# EAGLE schematic avr-grundschaltung (EAGLE 4.16)
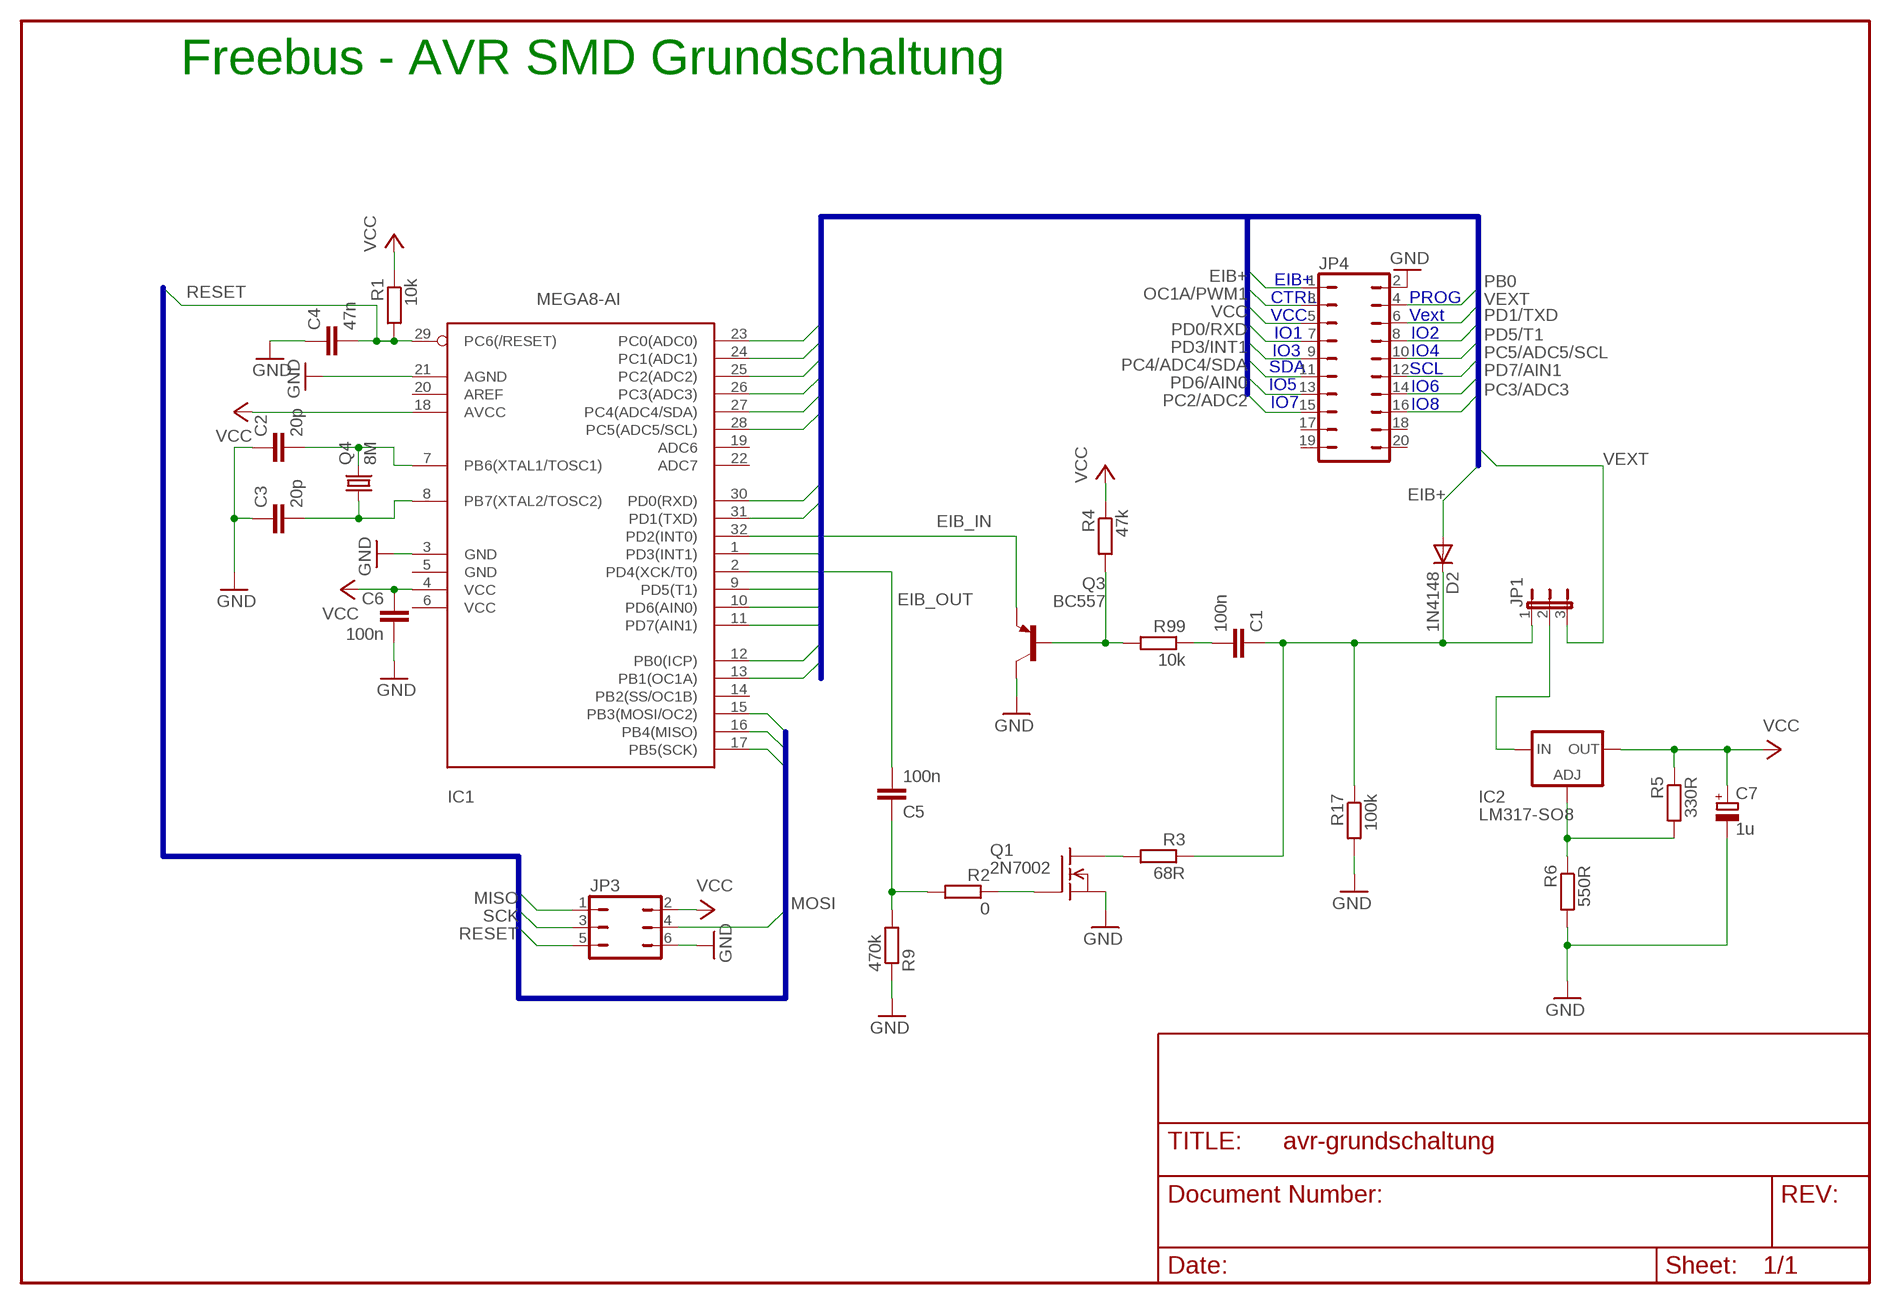
[diagram p0: schematic, sheet 1]

## Parts
C1  100n  C-EUC1206  [C1206]
C2  20p  C-EUC1206  [C1206]
C3  20p  C-EUC1206  [C1206]
C4  47n  C-EUC1206  [C1206]
C5  100n  C-EUC1206  [C1206]
C6  100n  C-EUC1206  [C1206]
C7  1u  CPOL-EUSMCB  [SMC_B]
D2  1N4148  DIODE-SOD80C  [SOD80C]
IC1  MEGA8-AI  [TQFP32-08]
IC2  LM317-SO8  [SO-8]
JP1  JP2E  [JP2]
JP3  JP3Q  [JP3Q]
JP4  JP10Q  [JP10Q]
Q1  2N7002  [SOT23]
Q3  BC557  [TO92]
Q4  8M  CRYSTALHC49UP  [HC49UP]
R1  10k  R-EU_M1206  [M1206]
R2  0  R-EU_R1206  [R1206]
R3  68R  R-EU_R1206  [R1206]
R4  47k  R-EU_R1206  [R1206]
R5  330R  R-EU_R1206  [R1206]
R6  550R  R-EU_R1206  [R1206]
R9  470k  R-EU_R1206  [R1206]
R17  100k  R-EU_R1206  [R1206]
R99  10k  R-EU_R1206  [R1206]

## Nets
EIB+: D2.A JP4.1
EIB_IN: IC1.32(PD2(INT0)) Q3.1(E)
EIB_OUT: C5.2 IC1.2(PD4(XCK/T0))
GND [supply]: C2.1 C3.1 C4.1 C6.2 C7.- IC1.3(GND) IC1.21(AGND) JP3.6 JP4.2 Q1.2(S) Q3.3(C) R6.2 R9.1 R17.2
MISO: IC1.16(PB4(MISO)) JP3.1
MOSI: IC1.15(PB3(MOSI/OC2)) JP3.4
N$1 [supply]: C1.2 R99.1
N$2: IC2.4(ADJ) R5.2 R6.1
N$3 [supply]: C1.1 D2.C JP1.1 R3.1 R17.1
N$5 [supply]: Q1.3(D) R3.2
N$6 [supply]: IC2.1(IN) JP1.2
N$7 [supply]: Q3.2(B) R4.2 R99.2
N$8: C2.2 IC1.7(PB6(XTAL1/TOSC1)) Q4.2
N$9: C3.2 IC1.8(PB7(XTAL2/TOSC2)) Q4.1
N$12: C5.1 R2.2 R9.2
N$23: Q1.1(G) R2.1
OC1A/PWM1: IC1.13(PB1(OC1A)) JP4.3
PB0: IC1.12(PB0(ICP)) JP4.4
PC0/ADC0: IC1.23(PC0(ADC0))
PC1/ADC1: IC1.24(PC1(ADC1))
PC2/ADC2: IC1.25(PC2(ADC2)) JP4.15
PC3/ADC3: IC1.26(PC3(ADC3)) JP4.16
PC4/ADC4/SDA: IC1.27(PC4(ADC4/SDA)) JP4.11
PC5/ADC5/SCL: IC1.28(PC5(ADC5/SCL)) JP4.12
PD0/RXD: IC1.30(PD0(RXD)) JP4.7
PD1/TXD: IC1.31(PD1(TXD)) JP4.8
PD3/INT1: IC1.1(PD3(INT1)) JP4.9
PD5/T1: IC1.9(PD5(T1)) JP4.10
PD6/AIN0: IC1.10(PD6(AIN0)) JP4.13
PD7/AIN1: IC1.11(PD7(AIN1)) JP4.14
RESET: C4.2 IC1.29(PC6(/RESET)) JP3.5 R1.2
SCK: IC1.17(PB5(SCK)) JP3.3
VCC: C6.1 C7.+ IC1.4(VCC) IC1.18(AVCC) IC2.6(OUT) JP3.2 JP4.5 R1.1 R4.1 R5.1
VEXT [supply]: JP1.3 JP4.6
Unconnected: IC1.5(GND) IC1.6(VCC) IC1.14(PB2(SS/OC1B)) IC1.19(ADC6) IC1.20(AREF) IC1.22(ADC7) IC2.2(OUT) IC2.3(OUT) IC2.5(NC) IC2.7(OUT) IC2.8(NC) JP4.17 JP4.18 JP4.19 JP4.20

## Buses
PC0/ADC0,PC1/ADC1,PC2/ADC2,PC3/ADC3,PC4/ADC4/SDA,PC5/ADC5/SCL,PD0/RXD,PD1/TXD,EIB+,OC1A/PWM1,OC1B/PWM2,VEXT,PB0,VCC,PD3/INT1,PD5/T1,PD6/AIN0,PD7/AIN1
MOSI,MISO,SCK,RESET

## Notes on the sheet
- Freebus - AVR SMD Grundschaltung
- EIB+
- CTRL | PROG
- VCC | Vext
- IO1 | IO2
- IO3 | IO4
- SDA | SCL
- IO5 | IO6
- IO7 | IO8

## Library data of the parts
C1-C6 = rcl:C-EU: CAPACITOR, European symbol
C7 = rcl:CPOL-EU: POLARIZED CAPACITOR, European symbol
D2 = diode:DIODE-: DIODE
IC1 = atmel:MEGA8: MICROCONTROLLER 8 Kbytes FLASH 1 kbytes SRAM 512 bytes EEPROM USART 6-channel 10 bit ADC 2-channel 8 bit ADC Source: avr.lbr
IC2 = freebus:LM317-SO8
JP1 = jumper:JP2E: JUMPER
JP3 = jumper:JP3Q: JUMPER
JP4 = jumper:JP10Q: JUMPER
Q1 = freebus:2N7002
Q3 = transistor-pnp:BC557: PNP Transistor
Q4 = crystal:CRYSTAL: CRYSTAL
R1-R6 R9 R17 R99 = rcl:R-EU_: RESISTOR, European symbol